# Altium schematic sheet Biquad_Sim.SchDoc
size A; SheetNumber: 3; SheetTotal: 3
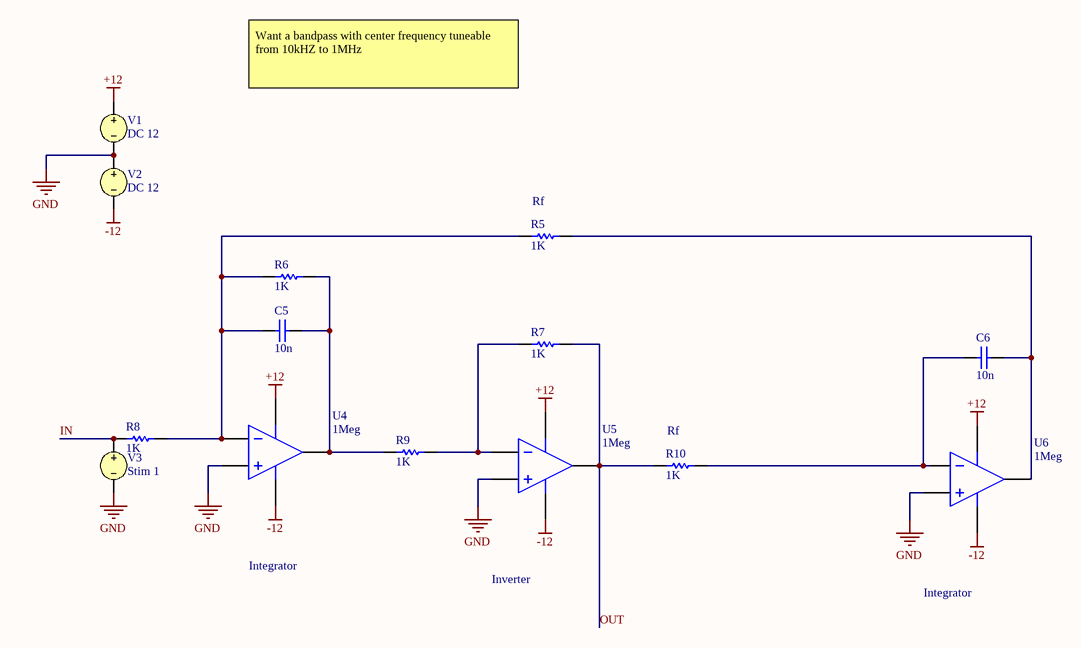
[diagram p0: Biquad_Sim.SchDoc]

## Parts
C5  value 10n  (hidden comment: Capacitor)
C6  value 10n  (hidden comment: Capacitor)
R5  value 1K  (hidden comment: Resistor)
R6  value 1K  (hidden comment: Resistor)
R7  value 1K  (hidden comment: Resistor)
R8  value 1K  (hidden comment: Resistor)
R9  value 1K  (hidden comment: Resistor)
R10  value 1K  (hidden comment: Resistor)
U4  GAIN: 1Meg  (hidden comment: Ideal Operational Amplifier)
U5  GAIN: 1Meg  (hidden comment: Ideal Operational Amplifier)
U6  GAIN: 1Meg  (hidden comment: Ideal Operational Amplifier)
V1  DC 12
V2  DC 12
V3  Stim 1

## Nets
+12: U4.4(V+) U5.4(V+) U6.4(V+) V1.1
-12: U4.5(V-) U5.5(V-) U6.5(V-) V2.2
GND: U4.2(IN+) U5.2(IN+) U6.2(IN+) V1.2 V2.1 V3.2
IN: R8.1 V3.1
OUT: R7.2 R10.1 U5.3(OUT)
NetC5_1: C5.1 R5.1 R6.1 R8.2 U4.1(IN-)
NetC5_2: C5.2 R6.2 R9.1 U4.3(OUT)
NetC6_1: C6.1 R10.2 U6.1(IN-)
NetC6_2: C6.2 R5.2 U6.3(OUT)
NetR7_1: R7.1 R9.2 U5.1(IN-)

## Notes on the sheet
- Want a bandpass with center frequency tuneable from 10kHZ to 1MHz
- (near R5) Rf
- (near R10) Rf
- Integrator
- Inverter

## Library data of the parts
C5 C6 = Capacitor: SimulationGenericComponent: True
R5-R10 = Resistor: TC1: 0; SimulationGenericComponent: True; TC2: 0
U4-U6 = OpAmp with power terminals: SimulationGenericComponent: True
V1 V2 = VSRC: Voltage Source; Note: PCB Footprint - Not required; AC Magnitude: 1; AC Phase: 0; Value: 12; Published: 8-Jun-2000; LatestRevisionDate: 17-Jul-2002; LatestRevisionNote: Re-released for DXP Platform.; PackageReference: Not Applicable; Publisher: Altium Limited
V3 = VSRC: Voltage Source; Note: PCB Footprint - Not required; AC Magnitude: 1; AC Phase: 0; Frequency: 1K; Published: 8-Jun-2000; LatestRevisionDate: 17-Jul-2002; LatestRevisionNote: Re-released for DXP Platform.; PackageReference: Not Applicable; Publisher: Altium Limited; DC Magnitude: 0; Offset: 0; Amplitude: 1; Delay: 0; Damping Factor: 0; Phase: 0